# Altium schematic sheet GoodBoy_V1_nRF9160dk_base.SchDoc
size A3
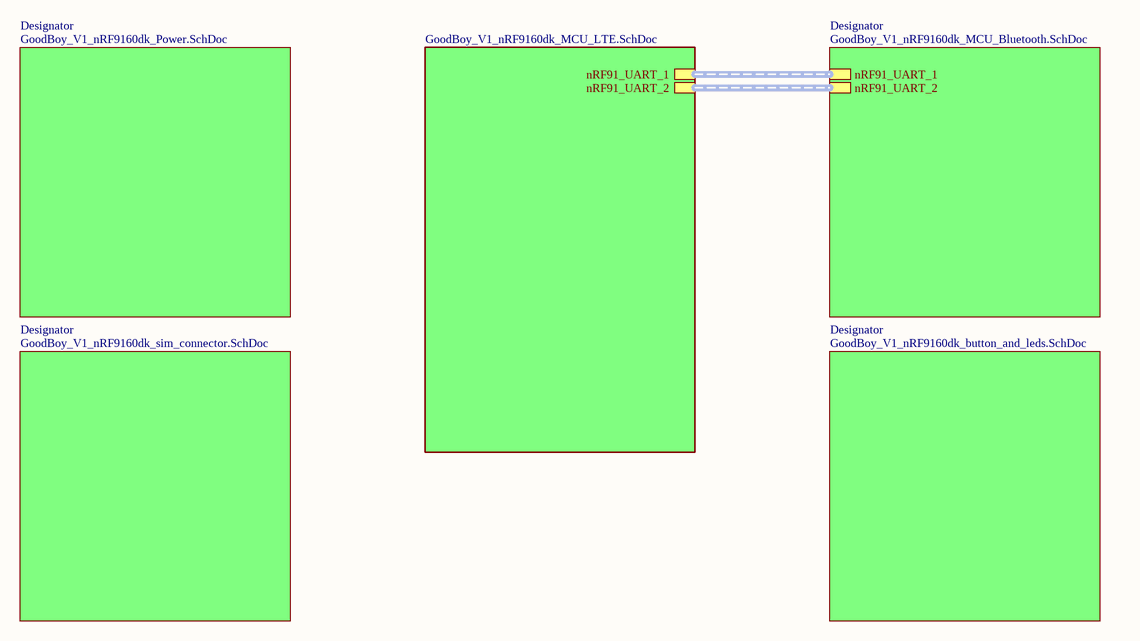
[diagram p0: GoodBoy_V1_nRF9160dk_base.SchDoc]

## Sub-sheets
Designator = GoodBoy_V1_nRF9160dk_Power.SchDoc: no entries
Designator = GoodBoy_V1_nRF9160dk_sim_connector.SchDoc: no entries
Designator = GoodBoy_V1_nRF9160dk_MCU_Bluetooth.SchDoc: nRF91_UART_1 (harness UART), nRF91_UART_2 (harness UART)
Designator = GoodBoy_V1_nRF9160dk_button_and_leds.SchDoc: no entries
? = GoodBoy_V1_nRF9160dk_MCU_LTE.SchDoc: nRF91_UART_1 (harness UART), nRF91_UART_2 (harness UART)

## Buses and harness runs
harness sheet /nRF91_UART_1 = sheet Designator/nRF91_UART_1
harness sheet /nRF91_UART_2 = sheet Designator/nRF91_UART_2